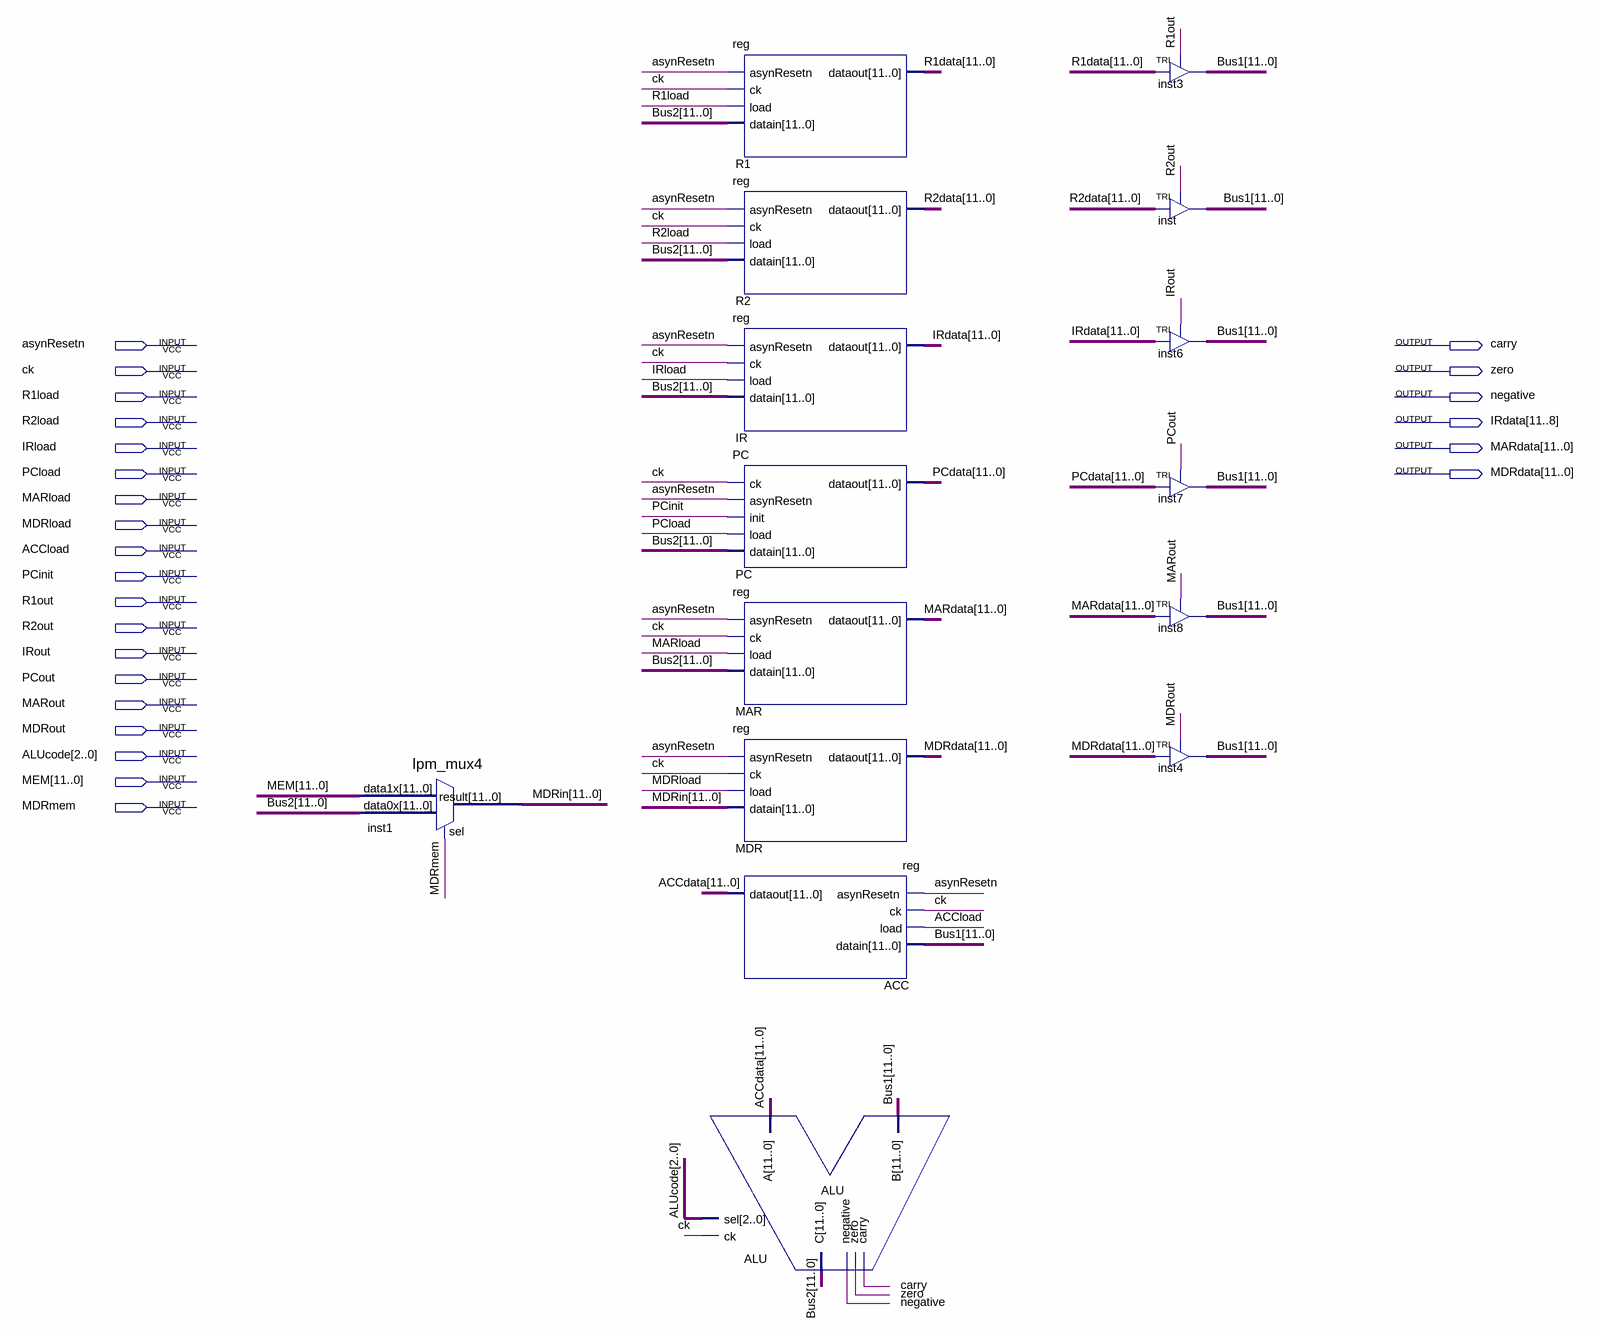
[diagram p0: schematic sheet]
// Quartus schematic UP.bdf as structural Verilog: 15 symbols, 25 pins
module UP (
  input  asynResetn,
  input  ck,
  input  R1load,
  input  R2load,
  input  IRload,
  input  PCload,
  input  MARload,
  input  MDRload,
  input  ACCload,
  input  PCinit,
  input  R1out,
  input  R2out,
  input  IRout,
  input  PCout,
  input  MARout,
  input  MDRout,
  input  [2:0] ALUcode,
  input  [11:0] MEM,
  input  MDRmem,
  output carry,
  output zero,
  output negative,
  output [11:0] IRdata,
  output [11:0] MARdata,
  output [11:0] MDRdata
);

  wire [11:0] ACCdata, Bus1, Bus2, MDRin, PCdata, R1data, R2data;

  lpm_mux4 inst1 (.data1x(MEM), .data0x(Bus2), .sel(MDRmem), .result(MDRin));
  \reg  R1 (.asynResetn(asynResetn), .ck(ck), .load(R1load), .datain(Bus2), .dataout(R1data));
  \reg  R2 (.asynResetn(asynResetn), .ck(ck), .load(R2load), .datain(Bus2), .dataout(R2data));
  \reg  IR (.asynResetn(asynResetn), .ck(ck), .load(IRload), .datain(Bus2), .dataout(IRdata));
  PC PC (.ck(ck), .asynResetn(asynResetn), .init(PCinit), .load(PCload), .datain(Bus2), .dataout(PCdata));
  \reg  MAR (.asynResetn(asynResetn), .ck(ck), .load(MARload), .datain(Bus2), .dataout(MARdata));
  \reg  MDR (.asynResetn(asynResetn), .ck(ck), .load(MDRload), .datain(MDRin), .dataout(MDRdata));
  \reg  ACC (.asynResetn(asynResetn), .ck(ck), .load(ACCload), .datain(Bus1), .dataout(ACCdata));
  ALU ALU (.A(ACCdata), .B(Bus1), .ck(ck), .sel(ALUcode), .C(Bus2), .carry(carry), .zero(zero), .negative(negative));
  TRI inst3[11:0] (.IN(R1data), .OE(R1out), .OUT(Bus1));
  TRI inst[11:0] (.IN(R2data), .OE(R2out), .OUT(Bus1));
  TRI inst6[11:0] (.IN(IRdata), .OE(IRout), .OUT(Bus1));
  TRI inst7[11:0] (.IN(PCdata), .OE(PCout), .OUT(Bus1));
  TRI inst8[11:0] (.IN(MARdata), .OE(MARout), .OUT(Bus1));
  TRI inst4[11:0] (.IN(MDRdata), .OE(MDRout), .OUT(Bus1));
endmodule
